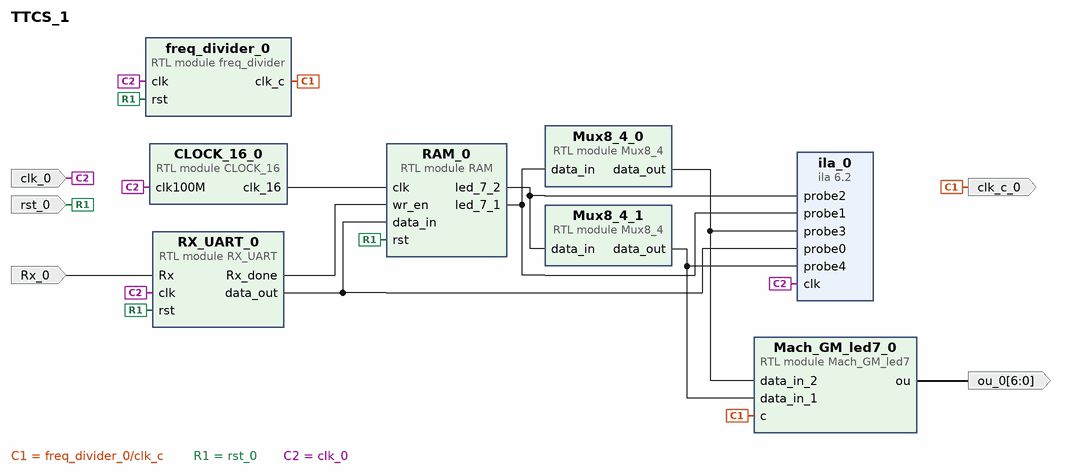
[diagram p0: block diagram of the top level]
# Vivado block design TTCS_1, xc7a35ticsg324-1L, Vivado 2020.2.2
create_bd_design TTCS_1

create_bd_port -dir I -type rst rst_0
create_bd_port -dir I Rx_0
create_bd_port -dir O -from 6 -to 0 ou_0
create_bd_port -dir O clk_c_0
create_bd_port -dir I -type clk clk_0

create_bd_cell -type module -reference RX_UART RX_UART_0
create_bd_cell -type module -reference Mach_GM_led7 Mach_GM_led7_0
create_bd_cell -type module -reference CLOCK_16 CLOCK_16_0
create_bd_cell -type module -reference Mux8_4 Mux8_4_0
create_bd_cell -type module -reference Mux8_4 Mux8_4_1
create_bd_cell -type module -reference RAM RAM_0
create_bd_cell -type module -reference freq_divider freq_divider_0
create_bd_cell -type ip -vlnv xilinx.com:ip:ila:6.2 ila_0
set_property -dict [list \
  CONFIG.C_ENABLE_ILA_AXI_MON false \
  CONFIG.C_MONITOR_TYPE Native \
  CONFIG.C_NUM_OF_PROBES 5 \
  CONFIG.C_PROBE0_WIDTH 8 \
  CONFIG.C_PROBE1_WIDTH 8 \
  CONFIG.C_PROBE2_WIDTH 8 \
  CONFIG.C_PROBE3_WIDTH 4 \
  CONFIG.C_PROBE4_WIDTH 4 \
  CONFIG.C_PROBE5_WIDTH 1 \
  CONFIG.C_PROBE6_WIDTH 1 \
] [get_bd_cells ila_0]

# ---- connections ----

connect_bd_net -net Rx_0_1 [get_bd_ports Rx_0] [get_bd_pins RX_UART_0/Rx]
connect_bd_net [get_bd_pins RAM_0/led_7_1] [get_bd_pins Mux8_4_0/data_in] [get_bd_pins ila_0/probe1]
connect_bd_net [get_bd_pins RAM_0/led_7_2] [get_bd_pins Mux8_4_1/data_in] [get_bd_pins ila_0/probe2]
connect_bd_net [get_bd_pins Mach_GM_led7_0/ou] [get_bd_ports ou_0]
connect_bd_net [get_bd_pins freq_divider_0/clk_c] [get_bd_ports clk_c_0] [get_bd_pins Mach_GM_led7_0/c]
connect_bd_net -net rst_0_1 [get_bd_ports rst_0] [get_bd_pins RX_UART_0/rst] [get_bd_pins RAM_0/rst] [get_bd_pins freq_divider_0/rst]
connect_bd_net [get_bd_pins RX_UART_0/data_out] [get_bd_pins RAM_0/data_in] [get_bd_pins ila_0/probe0]
connect_bd_net [get_bd_pins RX_UART_0/Rx_done] [get_bd_pins RAM_0/wr_en]
connect_bd_net -net clk_0_1 [get_bd_ports clk_0] \
  [get_bd_pins CLOCK_16_0/clk100M] [get_bd_pins RX_UART_0/clk] [get_bd_pins freq_divider_0/clk] [get_bd_pins ila_0/clk]
connect_bd_net [get_bd_pins CLOCK_16_0/clk_16] [get_bd_pins RAM_0/clk]
connect_bd_net [get_bd_pins Mux8_4_0/data_out] [get_bd_pins Mach_GM_led7_0/data_in_2] [get_bd_pins ila_0/probe3]
connect_bd_net [get_bd_pins Mux8_4_1/data_out] [get_bd_pins Mach_GM_led7_0/data_in_1] [get_bd_pins ila_0/probe4]

validate_bd_design
save_bd_design
